# EAGLE design svis_realsense_d435 (EAGLE 6.6.0)
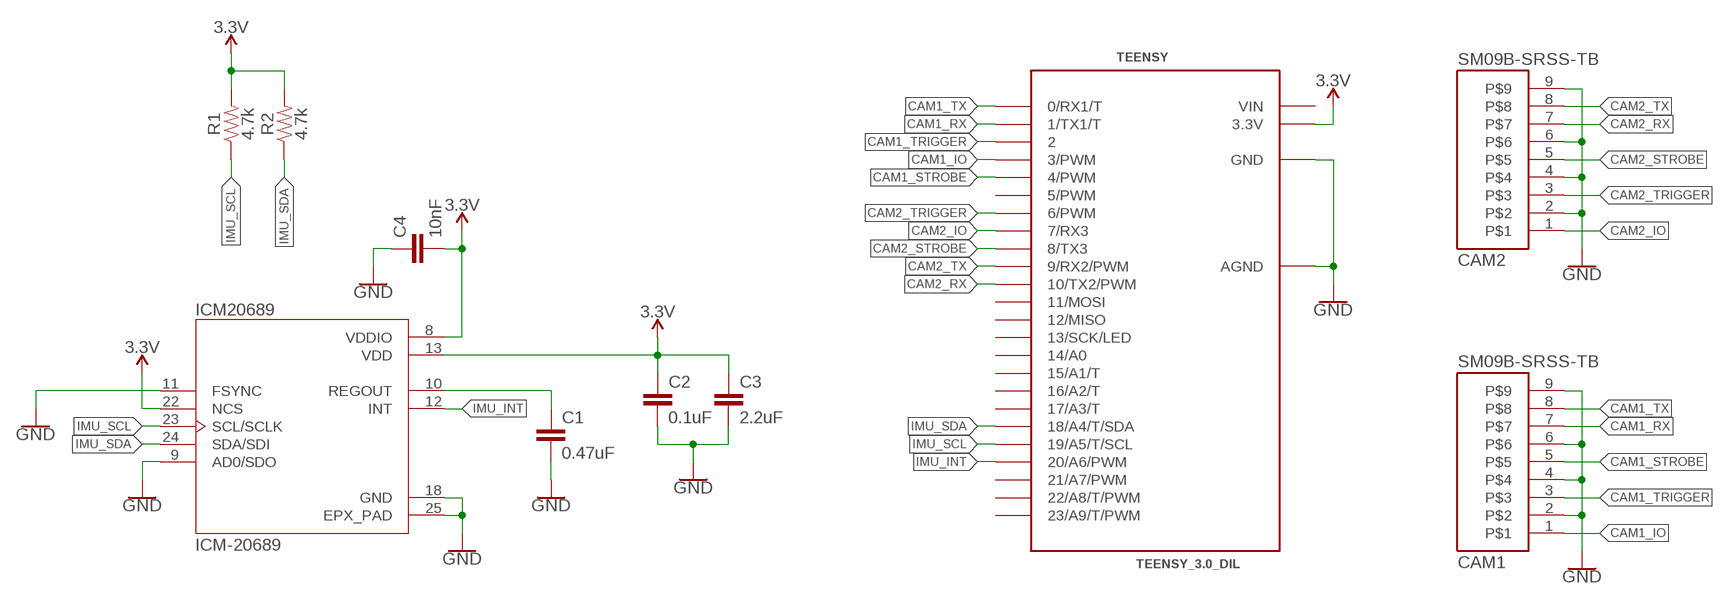
[diagram p0: schematic, sheet 1]

## Parts
C1  0.47uF  0.1UF-0603-25V-(+80/-20%)  [0603]
C2  0.1uF  0.1UF-0603-25V-(+80/-20%)  [0603]
C3  2.2uF  2.2UF-0603-10V-20%  [0603]
C4  10nF  0.1UF-0603-25V-(+80/-20%)  [0603]
CAM1  SM09B-SRSS-TB  [SM09B-SRSS-TB]
CAM2  SM09B-SRSS-TB  [SM09B-SRSS-TB]
ICM20689  ICM-20689  [QFN50P400X400X95-25N]
R1  4.7k  4.7KOHM-0603-1/10W-1%  [0603]
R2  4.7k  4.7KOHM-0603-1/10W-1%  [0603]
TEENSY  TEENSY_3.0_DIL  [TEENSY_3.0-3.2&LC_DIL]

## Nets
3.3V: C2.1 C3.1 C4.2 ICM20689.8(VDDIO) ICM20689.13(VDD) ICM20689.22(NCS) R1.2 R2.2 TEENSY.3.3V
CAM1_IO: CAM1.1 TEENSY.3(3/PWM)
CAM1_RX: CAM1.7 TEENSY.1(1/TX1/T)
CAM1_STROBE: CAM1.5 TEENSY.4(4/PWM)
CAM1_TRIGGER: CAM1.3 TEENSY.2
CAM1_TX: CAM1.8 TEENSY.0(0/RX1/T)
CAM2_IO: CAM2.1 TEENSY.7(7/RX3)
CAM2_RX: CAM2.7 TEENSY.10(10/TX2/PWM)
CAM2_STROBE: CAM2.5 TEENSY.8(8/TX3)
CAM2_TRIGGER: CAM2.3 TEENSY.6(6/PWM)
CAM2_TX: CAM2.8 TEENSY.9(9/RX2/PWM)
GND: C1.2 C2.2 C3.2 C4.1 CAM1.2 CAM1.4 CAM1.6 CAM1.9 CAM2.2 CAM2.4 CAM2.6 CAM2.9 ICM20689.9(AD0/SDO) ICM20689.11(FSYNC) ICM20689.18(GND) ICM20689.25(EPX_PAD) TEENSY.AGND TEENSY.GND
IMU_INT: ICM20689.12(INT) TEENSY.20/A6(20/A6/PWM)
IMU_SCL: ICM20689.23(SCL/SCLK) R1.1 TEENSY.19/A5(19/A5/T/SCL)
IMU_SDA: ICM20689.24(SDA/SDI) R2.1 TEENSY.18/A4(18/A4/T/SDA)
N$1: C1.1 ICM20689.10(REGOUT)
Unconnected: TEENSY.5(5/PWM) TEENSY.11(11/MOSI) TEENSY.12(12/MISO) TEENSY.13(13/SCK/LED) TEENSY.14/A0 TEENSY.15/A1(15/A1/T) TEENSY.16/A2(16/A2/T) TEENSY.17/A3(17/A3/T) TEENSY.21/A7(21/A7/PWM) TEENSY.22/A8(22/A8/T/PWM) TEENSY.23/A9(23/A9/T/PWM)

## Power pins joined to a net without a drawn wire
VIN: TEENSY.VIN

## Library data of the parts
C1 C4 = SparkFun-Capacitors:0.1UF: 0.1µF ceramic capacitors A capacitor is a passive two-terminal electrical component used to store electrical energy temporarily in an electric field.; PROD_ID: CAP-00810; VALUE: 0.1uF
C2 = SparkFun-Capacitors:0.1UF: 0.1µF ceramic capacitors A capacitor is a passive two-terminal electrical component used to store electrical energy temporarily in an electric field.; PROD_ID: CAP-00810
C3 = SparkFun-Capacitors:2.2UF: 2.2µF ceramic capacitors A capacitor is a passive two-terminal electrical component used to store electrical energy temporarily in an electric field.; PROD_ID: CAP-07888
CAM1 CAM2 = svis:SM09B-SRSS-TB
ICM20689 = svis:ICM-20689: 6-Axis Drone/Vr/Iot Solution (Pi); AVAILABILITY: Unavailable; DESCRIPTION: 6-Axis Drone/Vr/Iot Solution _Pi; MF: TDK-InvenSense; MP: ICM-20689; PACKAGE: QFN-24 InvenSense; PRICE: None
R1 R2 = SparkFun-Resistors:4.7KOHM: 4.7kΩ resistor A resistor is a passive two-terminal electrical component that implements electrical resistance as a circuit element. Resistors act to reduce current flow, and, at the same time, act to lower voltage levels within circuits. - Wikipedia; PROD_ID: RES-07857
TEENSY = teensy:TEENSY_3.0_DIL: TEENSY 3.0 in a classic breadboard layout - pins between the two outer rows.

## Net classes
0 default: clearance 0.205 mm

## Board
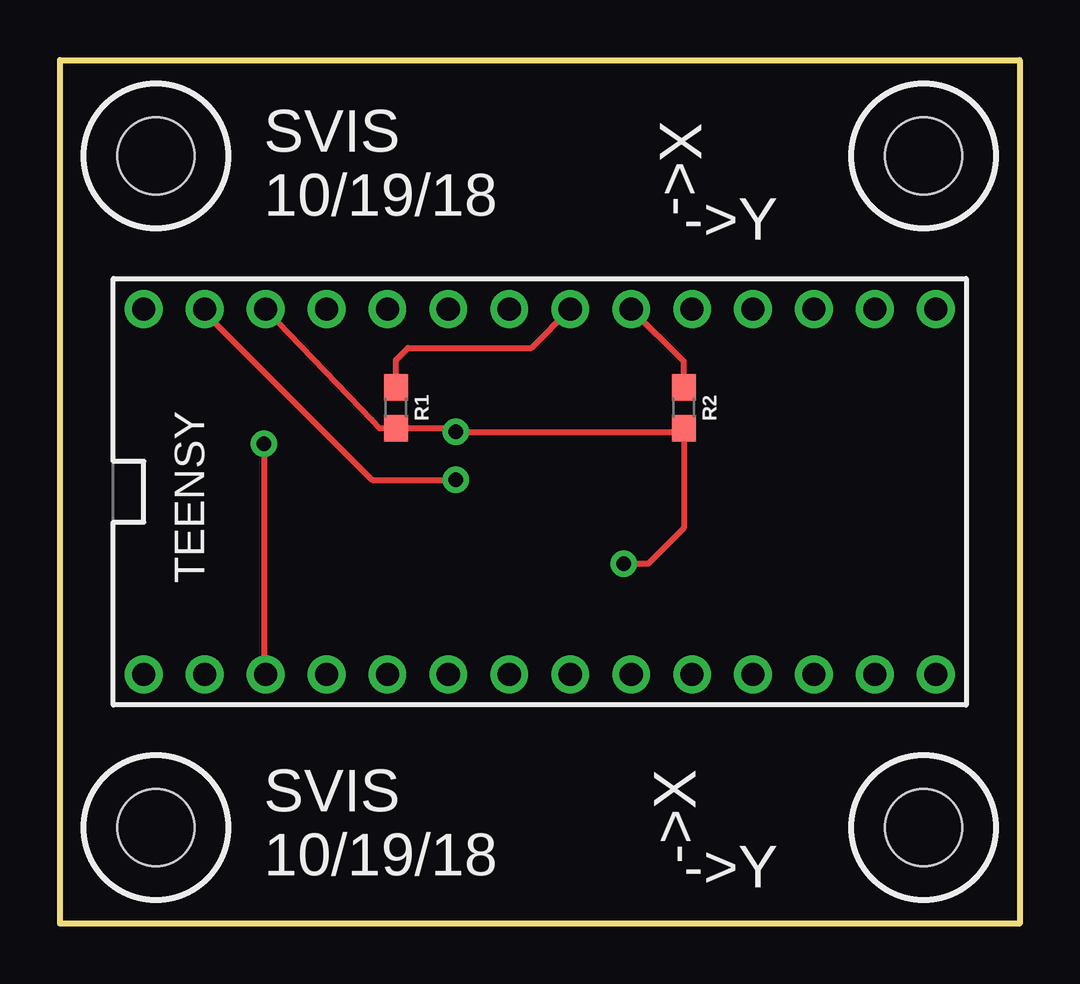
[diagram p1: board, top side]
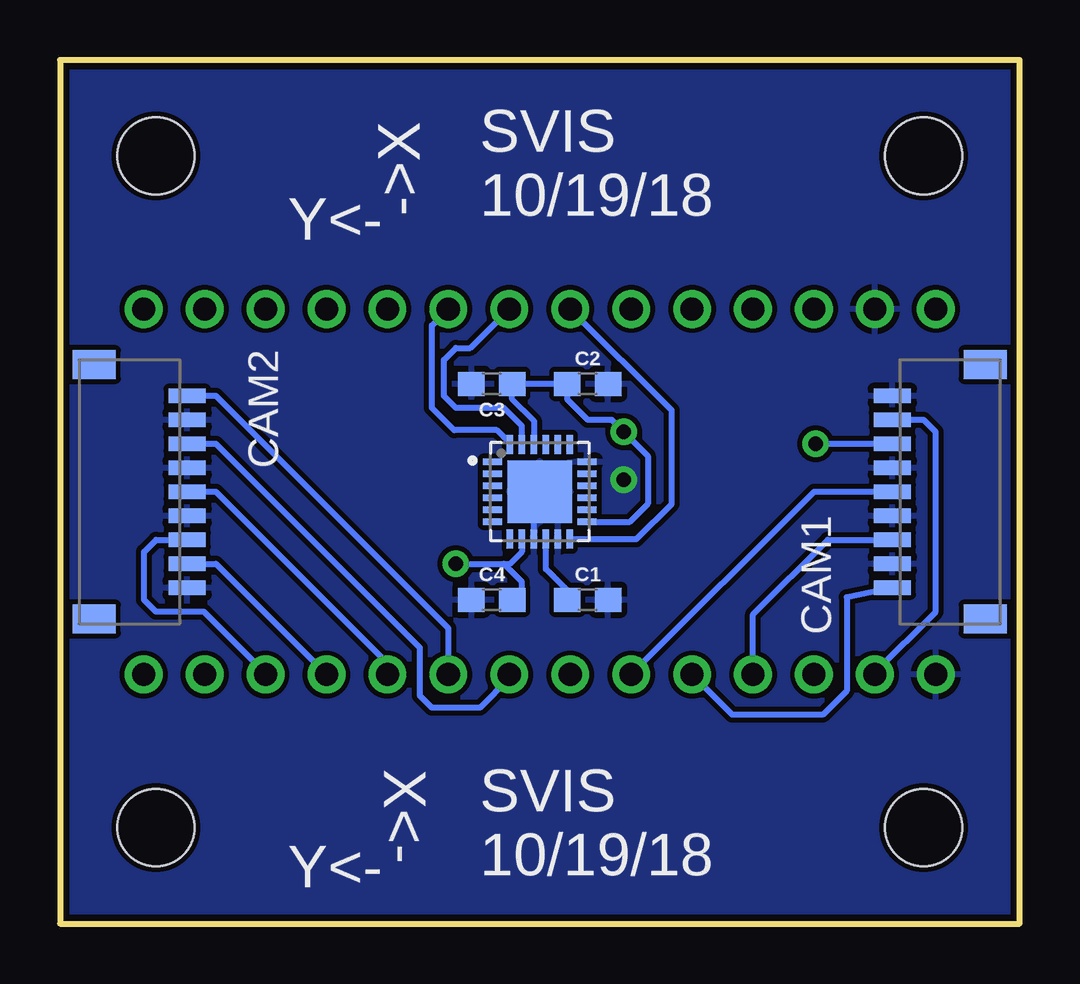
[diagram p2: board, bottom side, seen from below]

Size 40 x 36 mm. Coordinates in mm from the lower left corner, seen from the top.
Outline: 0,0 0,36 40,36 40,0 0,0
Copper layers (1*16): Top 0.035mm / dielectric 1.5mm / Bottom 0.035mm
Design rules "sparkfun": minimum track width 8mil, minimum drill 20mil, track to track 8mil, track to pad 8mil, pad to pad 8mil, via to via 8mil, smd to smd 8mil, copper to edge 10mil, drill to drill 8mil, minimum pad ring 12mil, minimum via ring 10mil, stop-mask expansion 4mil, vias tented up to drill 25mil, thermal gap 10mil
Holes 3.2 mm at 4,4 4,32 36,32 36,4

### Footprints (pad centres in the part's own frame; a part is rotated, then mirrored left to right if it is on the bottom)
0603 = smd 1.1 x 1: 1 -0.85,0; 2 0.85,0
SM09B-SRSS-TB = smd 0.6 x 1.55: 1 -2.5,0; 2 -1.5,0; 3 -0.5,0; 4 0.5,0; 5 1.5,0; 6 2.5,0; 7 3.5,0; 8 4.5,0; 9 5.5,0 | smd 1.2 x 1.8: P-MOUNT1 -3.8,-3.875; P-MOUNT2 6.8,-3.875
QFN50P400X400X95-25N = smd 0.79 x 0.26: 1 -1.97,1.25; 2 -1.97,0.75; 3 -1.97,0.25; 4 -1.97,-0.25; 5 -1.97,-0.75; 6 -1.97,-1.25; 13 1.97,-1.25; 14 1.97,-0.75; 15 1.97,-0.25; 16 1.97,0.25; 17 1.97,0.75; 18 1.97,1.25 | smd 0.26 x 0.79: 7 -1.25,-1.97; 8 -0.75,-1.97; 9 -0.25,-1.97; 10 0.25,-1.97; 11 0.75,-1.97; 12 1.25,-1.97; 19 1.25,1.97; 20 0.75,1.97; 21 0.25,1.97; 22 -0.25,1.97; 23 -0.75,1.97; 24 -1.25,1.97 | smd 2.7 x 2.6: 25 0,0
TEENSY_3.0-3.2&LC_DIL = drill 0.965: 0 -7.62,13.97; 1 -7.62,11.43; 2 -7.62,8.89; 3 -7.62,6.35; 3.3V 7.62,11.43; 4 -7.62,3.81; 5 -7.62,1.27; 6 -7.62,-1.27; 7 -7.62,-3.81; 8 -7.62,-6.35; 9 -7.62,-8.89; 10 -7.62,-11.43; 11 -7.62,-13.97; 12 -7.62,-16.51; 13 7.62,-16.51; 14/A0 7.62,-13.97; 15/A1 7.62,-11.43; 16/A2 7.62,-8.89; 17/A3 7.62,-6.35; 18/A4 7.62,-3.81; 19/A5 7.62,-1.27; 20/A6 7.62,1.27; 21/A7 7.62,3.81; 22/A8 7.62,6.35; 23/A9 7.62,8.89; AGND 7.62,13.97; GND -7.62,16.51; VIN 7.62,16.51

### Placement (x,y rotation side)
C1  18,13.5 0 bottom
C2  18,22.5 0 bottom
C3  22,22.5 180 bottom
C4  22,13.5 0 bottom
CAM1  5.3,16.5 90 bottom
CAM2  34.7,19.5 270 bottom
ICM20689  20,18 0 bottom
R1  14,21.5 270 top
R2  26,21.5 270 top
TEENSY  20,18 90 top

### Tracks (layer width: path | path; a pad name or v marks a point on that pad's centre or on a via)
3.3V  (via drill 0.6)
  Top 0.254: R2.2 26,20.5 | 26,20.5 26,16.5 24.5,15 v23.5,15 | 26,20.5 v16.5,20.5 16.35,20.65 R1.2 13.33,20.65 13,21 TEENSY.3.3V
  Bottom 0.254: ICM20689.22 20.25,20.96 21.15,21.86 C3.1 C2.1 18.85,21.85 18,21 17,21 v16.5,20.5 15.5,19.5 15.5,17.5 16.25,16.75 ICM20689.13 | ICM20689.8 20.75,15.5 21.25,15 21.5,15 | C4.2 20.75,13.9 20.75,14.25 21.5,15 | v23.5,15 21.5,15
CAM1_IO
  Bottom 0.254: CAM1.1 7.2,13.6 7.2,9.7 8.2,8.7 11.97,8.7 TEENSY.3
CAM1_RX  (via drill 0.6)
  Top 0.254: v8.5,20 8.5,10.45 TEENSY.1
  Bottom 0.254: CAM1.7 v8.5,20
CAM1_STROBE
  Bottom 0.254: CAM1.5 8.57,18 TEENSY.4
CAM1_TRIGGER
  Bottom 0.254: TEENSY.2 11.11,12.89 8,16 CAM1.3
CAM1_TX
  Bottom 0.254: TEENSY.0 6.03,10.47 3.5,13 3.5,20.5 4,21 CAM1.8
CAM2_IO
  Bottom 0.254: TEENSY.7 23.81,12.31 33.5,22 CAM2.1
CAM2_RX
  Bottom 0.254: TEENSY.10 31.43,10.43 34,13 36,13 36.5,13.5 36.5,15.5 36,16 CAM2.7
CAM2_STROBE
  Bottom 0.254: TEENSY.8 26.35,10.85 33.5,18 CAM2.5
CAM2_TRIGGER
  Bottom 0.254: TEENSY.6 21.27,10.23 22.5,9 24.5,9 25,9.5 25,11.5 33.5,20 CAM2.3
CAM2_TX
  Bottom 0.254: CAM2.8 33.5,15 29,10.5 29,10.49 TEENSY.9
GND  (via drill 0.6)
  Top 0.254: TEENSY.AGND 6.03,25.47 13,18.5 v16.5,18.5
  Bottom 0.254: ICM20689.9 20.25,16.75 20,17
  pour Bottom (rank 2): 40,0 40,36 0,36 0,0
IMU_INT
  Bottom 0.254: ICM20689.12 15.97,16.03 14.5,17.5 14.5,21.39 TEENSY.20/A6
IMU_SCL
  Top 0.254: R1.1 14,23.5 14.5,24 19.65,24 TEENSY.19/A5
  Bottom 0.254: ICM20689.23 20.75,20.75 21.5,21.5 23.5,21.5 24,22 24,23.5 23.5,24 22.89,24 TEENSY.19/A5
IMU_SDA
  Top 0.254: R2.1 26,23.43 TEENSY.18/A4
  Bottom 0.254: ICM20689.24 21.25,20.03 21.79,20.57 23.57,20.57 24.5,21.5 24.5,24.93 TEENSY.18/A4
N$1
  Bottom 0.254: C1.1 18.85,13.88 19.75,14.78 ICM20689.10

### Text on the board
tNames: SVIS / 10/19/18 | ->X | ->Y | SVIS / 10/19/18 | ->Y | ->X
bNames: SVIS / 10/19/18 | ->X | Y<- | SVIS / 10/19/18 | ->X | Y<-